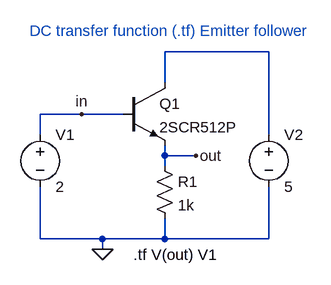
[diagram p0: schematic TF_EmitterFollower.asc]
TF_EmitterFollower.asc, the LTspice schematic file:
Version 4
SHEET 1 880 680
WIRE 384 -16 224 -16
WIRE 224 32 224 -16
WIRE 96 80 32 80
WIRE 160 80 96 80
WIRE 32 112 32 80
WIRE 384 112 384 -16
WIRE 224 144 224 128
WIRE 272 144 224 144
WIRE 224 160 224 144
WIRE 32 272 32 192
WIRE 128 272 32 272
WIRE 224 272 224 240
WIRE 224 272 128 272
WIRE 384 272 384 192
WIRE 384 272 224 272
WIRE 128 288 128 272
FLAG 128 288 0
FLAG 272 144 out
FLAG 96 80 in
SYMBOL voltage 32 96 R0
WINDOW 123 0 0 Left 2
WINDOW 39 0 0 Left 2
SYMATTR InstName V1
SYMATTR Value 2
SYMBOL npn 160 32 R0
SYMATTR InstName Q1
SYMATTR Value 2SCR512P
SYMBOL res 208 144 R0
SYMATTR InstName R1
SYMATTR Value 1k
SYMBOL voltage 384 96 R0
SYMATTR InstName V2
SYMATTR Value 5
TEXT 176 296 Left 2 !.tf V(out) V1
TEXT 16 -48 Left 2 ;DC transfer function (.tf) Emitter follower

The netlist it stands for:
* TF_EmitterFollower.asc
V1 in 0 2
Q1 N001 in out 0 2SCR512P
R1 out 0 1k
V2 N001 0 5
.model NPN NPN
.model PNP PNP
.lib standard.bjt
.tf V(out) V1
* DC transfer function (.tf) Emitter follower
.backanno
.end